# EAGLE design schmatic (EAGLE 9.6.2)
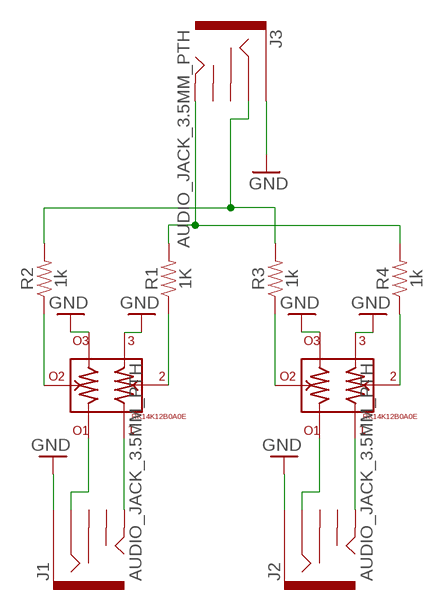
[diagram p0: schematic, sheet 1]

## Parts
J1  AUDIO_JACK_3.5MM_PTH  [AUDIO-JACK]
J2  AUDIO_JACK_3.5MM_PTH  [AUDIO-JACK]
J3  AUDIO_JACK_3.5MM_PTH  [AUDIO-JACK]
POT01  RK14K12B0A0E  [RK14K12B0A0E]
POT02  RK14K12B0A0E  [RK14K12B0A0E]
R1  1K  10MOHM-HORIZ-1/4W-5%  [AXIAL-0.3]
R2  1k  10MOHM-HORIZ-1/4W-5%  [AXIAL-0.3]
R3  1k  10MOHM-HORIZ-1/4W-5%  [AXIAL-0.3]
R4  1k  10MOHM-HORIZ-1/4W-5%  [AXIAL-0.3]

## Nets
GND: J1.SLEEVE J2.SLEEVE J3.SLEEVE POT01.3 POT01.O3 POT02.3 POT02.O3
N$1: POT02.O2 R2.P$1
N$2: POT02.2 R1.P$1
N$3: POT01.O2 R3.P$1
N$4: POT01.2 R4.P$1
N$5: J2.RING POT01.O1
N$6: J2.TIP POT01.1
N$7: J3.RING R2.P$2 R3.P$2
N$8: J3.TIP R1.P$2 R4.P$2
N$9: J1.TIP POT02.1
N$10: J1.RING POT02.O1
Unconnected: J1.RSH J1.TSH J2.RSH J2.TSH J3.RSH J3.TSH

## Library data of the parts
J1-J3 = SparkFun-Connectors:AUDIO_JACK_3.5MM: Audio Jack 3.5mm variants of PTH and SMT stereo audio jack with bypass switches. SparkFun Products: SparkFun SparkPunk Sound Kit <[https://www.sparkfun.com/products/11177]> - PTH MP3 Trigger <https://www.sparkfun.com/products/13720> -3.5mm SMD SparkFun PicoBoard <https://www.sparkfun.com/products/11888>- 2.5mm SMD; PROD_ID: CONN-08774; SF_ID: PRT-08032
POT01 POT02 = 2gPot:RK14K12B0A0E
R1-R4 = SparkFun-Resistors:10MOHM: RES-09327; PROD_ID: RES-09327; VALUE: 10M

## Board
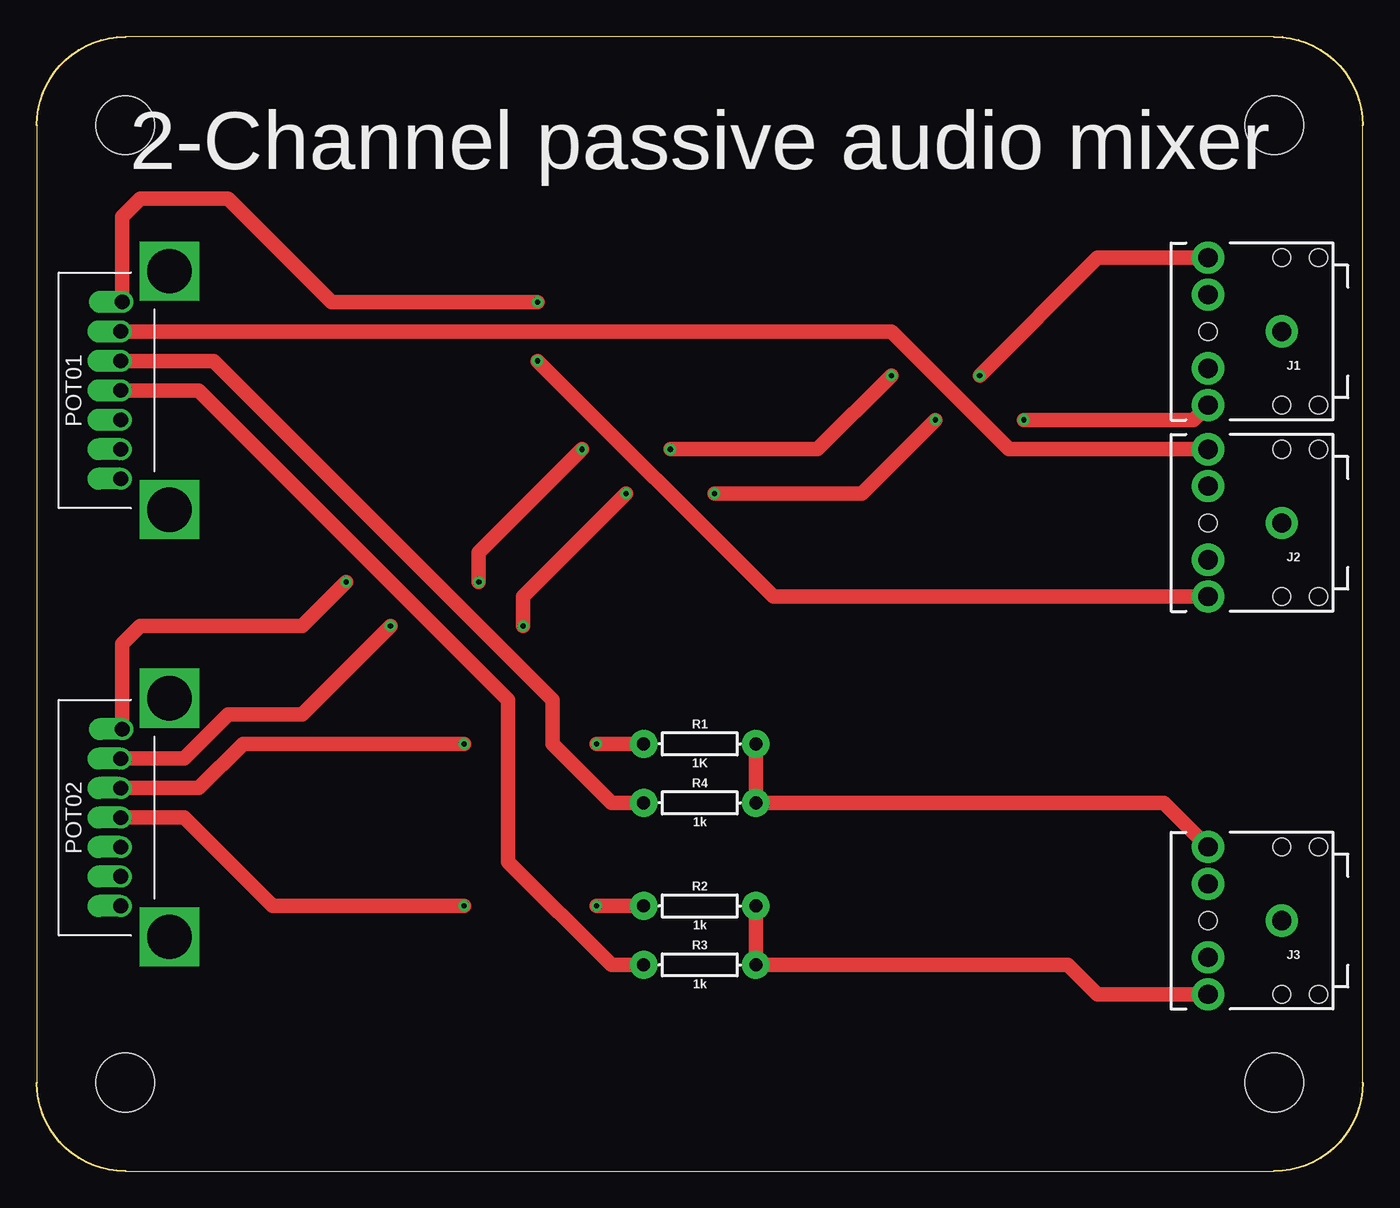
[diagram p1: board, top side]
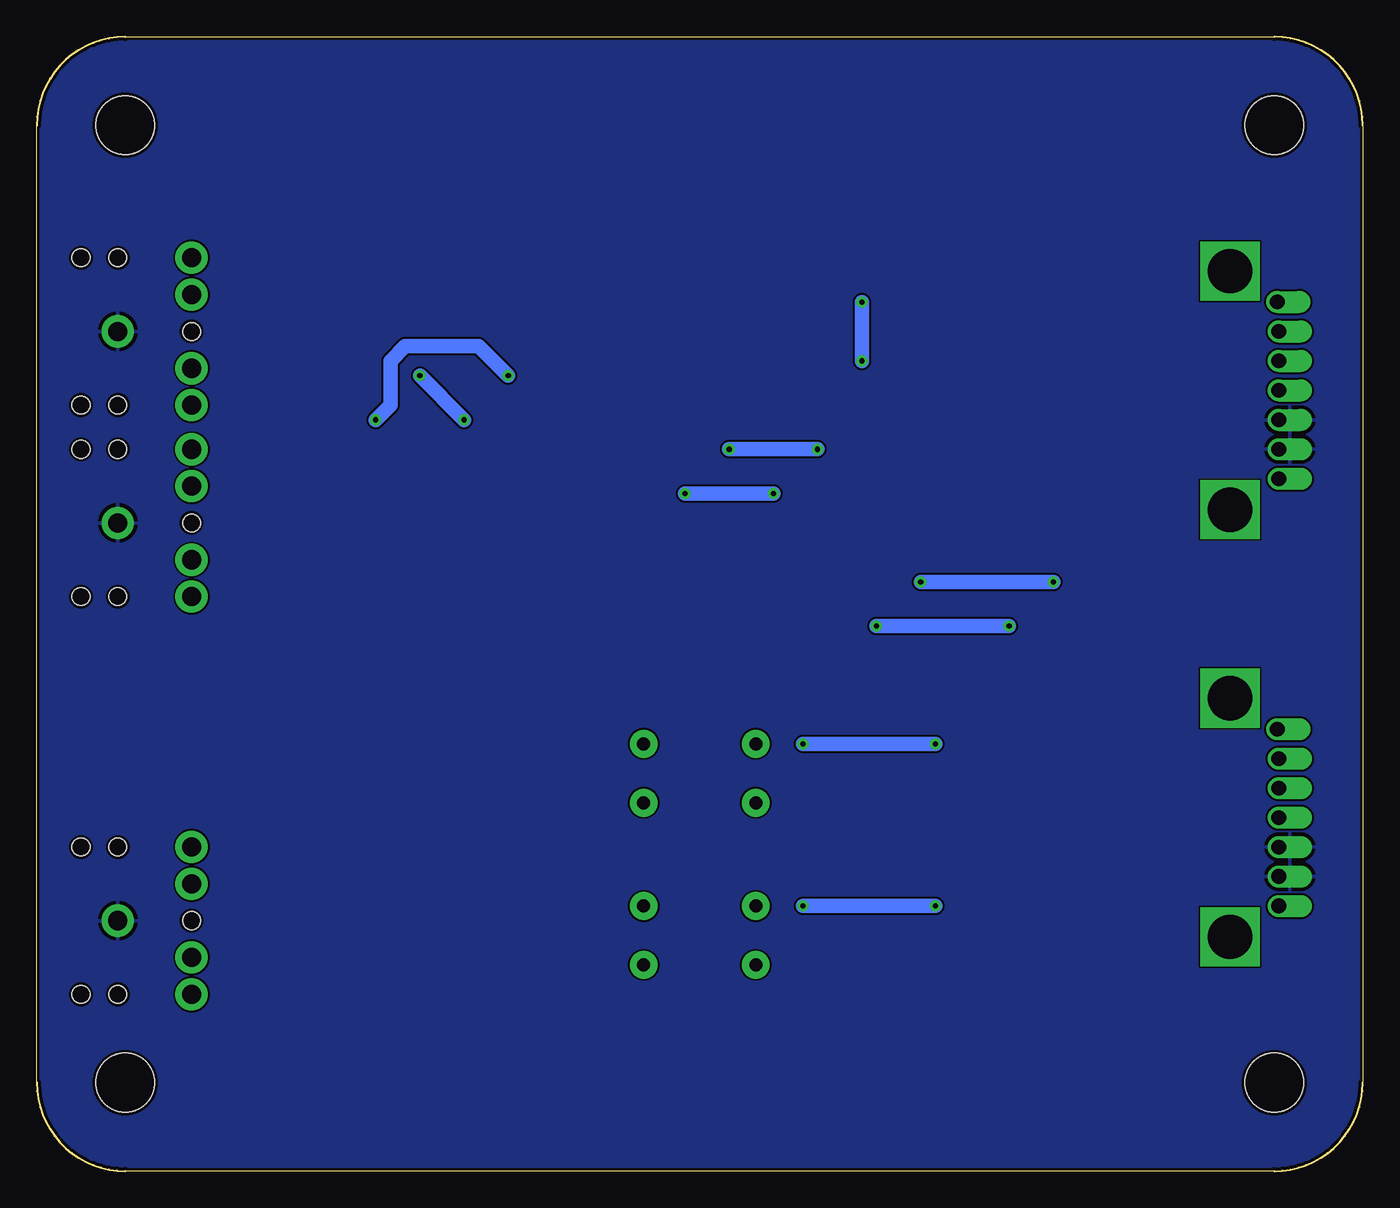
[diagram p2: board, bottom side, seen from below]

Size 90 x 77 mm. Coordinates in mm from the lower left corner, seen from the top.
Outline: 6,0 84,0 arc90 90,6 90,71 arc90 84,77 6,77 arc90 0,71 0,6 arc90 6,0
Copper layers (1*16): Top 0.035mm / dielectric 1.5mm / Bottom 0.035mm
Design rules "default *": minimum track width 6mil, minimum drill 0.35mm, track to track 5mil, track to pad 6mil, pad to pad 6mil, via to via 6mil, smd to smd 6mil, copper to edge 0.2mm, drill to drill 0.54mm, minimum pad ring 10mil, minimum via ring 8mil, stop-mask expansion 4mil, vias tented up to drill 0mil, thermal gap 10mil
Holes 4 mm at 6,6 84,6 6,71 84,71

### Footprints (pad centres in the part's own frame; a part is rotated, then mirrored left to right if it is on the bottom)
AUDIO-JACK = drill 1.3 pad 2.184: RING 5,5; RSH 5,2.5; SLEEVE 0,0; TIP 5,-5; TSH 5,-2.5 | hole 1.2: 0,5; -2.5,5; -2.5,-5; 0,-5; 5,0
RK14K12B0A0E = drill 1 offset: 1 -4,-3.3; 2 -2,-3.3; 3 2,-3.3; D1 6,-3.3; O1 -6,-3.2; O2 0,-3.3; O3 4,-3.3 | drill 3 square: D2 -8.1,0; D3 8.1,0
AXIAL-0.3 = drill 0.9 pad 1.88: P$1 -3.81,0; P$2 3.81,0

### Placement (x,y rotation side)
J1  84.5,57 180 top
J2  84.5,44 180 top
J3  84.5,17 180 top
POT01  9,53 270 top
POT02  9,24 270 top
R1  45,29 0 top
R2  45,18 0 top
R3  45,14 0 top
R4  45,25 0 top

### Tracks (layer width: path | path; a pad name or v marks a point on that pad's centre or on a via)
GND
  pour Bottom: -1,76 -1,0 5,-6 88,-6 105,11 105,61 84,82 5,82
N$1  (via drill 0.35)
  Top 1: R2.P$1 v38,18 | v29,18 16,18 10,24 POT02.O2
  Bottom 1: v29,18 v38,18
N$2  (via drill 0.35)
  Top 1: R1.P$1 v38,29 | POT02.2 11,26 14,29 v29,29
  Bottom 1: v29,29 v38,29
N$3
  Top 1: POT01.O2 11,53 32,32 32,21 39,14 R3.P$1
N$4
  Top 1: POT01.2 12,55 35,32 35,29 39,25 R4.P$1
N$5  (via drill 0.35)
  Top 1: J2.RING 50,39 v34,55 | v34,59 20,59 13,66 7,66 5.8,64.8 POT01.O1
  Bottom 1: v34,55 v34,59
N$6
  Top 1: POT01.1 58,57 66,49 J2.TIP
N$7
  Top 1: R2.P$2 R3.P$2 70,14 72,12 J3.RING
N$8
  Top 1: R1.P$2 R4.P$2 76.5,25 J3.TIP
N$9  (via drill 0.35)
  Top 1: J1.TIP 72,62 v64,54 | v61,51 56,46 v46,46 | v40,46 33,39 v33,37 | v24,37 18,31 13,31 10,28 POT02.1
  Bottom 1: v64,54 v61,51 | v33,37 v24,37 | v46,46 v40,46
N$10  (via drill 0.35)
  Top 1: POT02.O1 5.8,35.8 7,37 18,37 v21,40 | J1.RING 78.5,51 v67,51 | v58,54 53,49 v43,49 | v37,49 30,42 v30,40
  Bottom 1: v67,51 66,52 66,55 65,56 60,56 v58,54 | v30,40 v21,40 | v43,49 v37,49

### Text on the board
tPlace: 2-Channel passive audio mixer